# Altium schematic sheet MC21R01_BoardtoBoard_connectors.SchDoc: MC21R01 Top Level
size A3; Author: AMP; DrawnBy: AMP; Organization: Altium Limited; Address1: 3 Minna Close; Address2: Belrose; Address3: NSW 2085; Address4: Australia; DocumentNumber: 0; Revision: 1.0; SheetNumber: 0; SheetTotal: 0
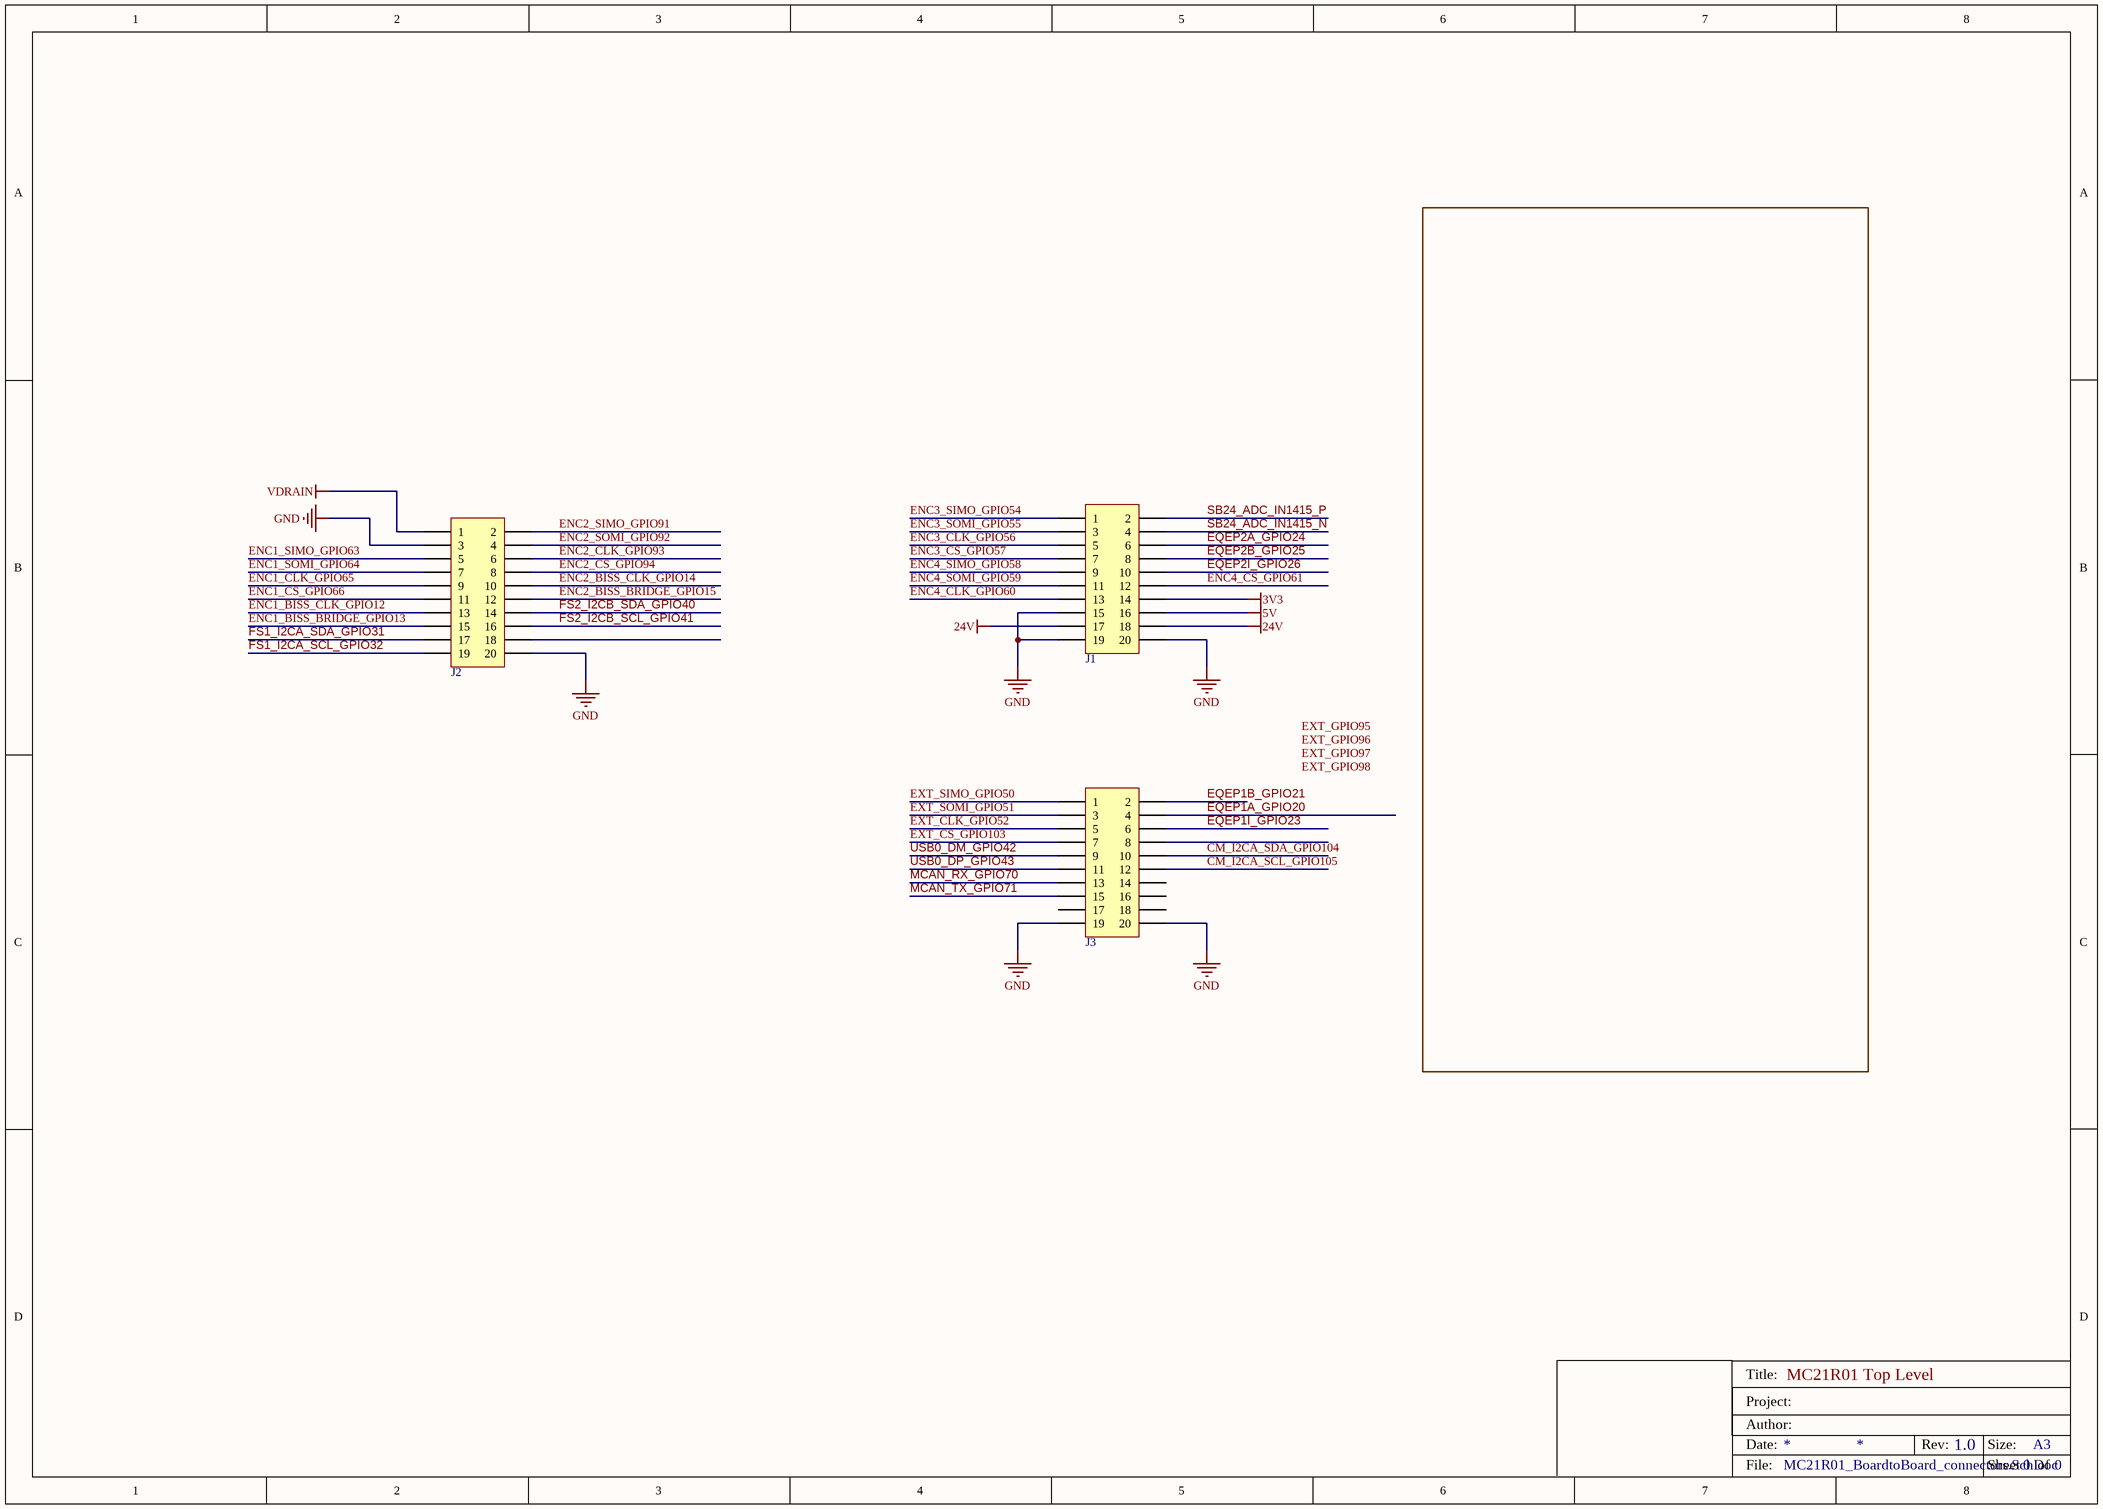
[diagram p0: MC21R01_BoardtoBoard_connectors.SchDoc]

## Parts
J1  Amphenol 20021321-00020C4LF  [Amphenol 20021321-10020C4LF]  (value not drawn)
J2  Amphenol 20021321-00020C4LF  [Amphenol 20021321-10020C4LF]  (value not drawn)
J3  Amphenol 20021321-00020C4LF  [Amphenol 20021321-10020C4LF]  (value not drawn)

## Nets
3V3: J1.14
5V: J1.16
24V: J1.17 J1.18
GND: J1.15 J1.19 J1.20 J2.3 J2.20 J3.19 J3.20
VDRAIN: J2.1
CM_I2CA_SCL_GPIO105: J3.12
CM_I2CA_SDA_GPIO104: J3.10
ENC1_BISS_BRIDGE_GPIO13: J2.15
ENC1_BISS_CLK_GPIO12: J2.13
ENC1_CLK_GPIO65: J2.9
ENC1_CS_GPIO66: J2.11
ENC1_SIMO_GPIO63: J2.5
ENC1_SOMI_GPIO64: J2.7
ENC2_BISS_BRIDGE_GPIO15: J2.12
ENC2_BISS_CLK_GPIO14: J2.10
ENC2_CLK_GPIO93: J2.6
ENC2_CS_GPIO94: J2.8
ENC2_SIMO_GPIO91: J2.2
ENC2_SOMI_GPIO92: J2.4
ENC3_CLK_GPIO56: J1.5
ENC3_CS_GPIO57: J1.7
ENC3_SIMO_GPIO54: J1.1
ENC3_SOMI_GPIO55: J1.3
ENC4_CLK_GPIO60: J1.13
ENC4_CS_GPIO61: J1.12
ENC4_SIMO_GPIO58: J1.9
ENC4_SOMI_GPIO59: J1.11
EQEP1A_GPIO20: J3.4
EQEP1B_GPIO21: J3.2
EQEP1I_GPIO23: J3.6
EQEP2A_GPIO24: J1.6
EQEP2B_GPIO25: J1.8
EQEP2I_GPIO26: J1.10
EXT_CLK_GPIO52: J3.5
EXT_CS_GPIO103: J3.7
EXT_SIMO_GPIO50: J3.1
EXT_SOMI_GPIO51: J3.3
FS1_I2CA_SCL_GPIO32: J2.19
FS1_I2CA_SDA_GPIO31: J2.17
FS2_I2CB_SCL_GPIO41: J2.16
FS2_I2CB_SDA_GPIO40: J2.14
MCAN_RX_GPIO70: J3.13
MCAN_TX_GPIO71: J3.15
SB24_ADC_IN1415_N: J1.4
SB24_ADC_IN1415_P: J1.2
USB0_DM_GPIO42: J3.9
USB0_DP_GPIO43: J3.11

Not connected (* = marked no-connect by the designer): J2 18; J3 8 14 16 17 18

## Notes on the sheet
- Title:
- Date:
- Project:
- Author:
- Rev:
- Size:
- A3
- File:
- Sheet
- of
- Labels drawn without touching a wire or pin: EXT_GPIO95, EXT_GPIO96, EXT_GPIO97, EXT_GPIO98

## Library data of the parts
J1-J3 = Amphenol 20021321-00020C4LF: Receptacle, Minitek127®, Board to Board connectors, PCB mounted Receptacle, Vertical, Surface Mount, Double Row, 20 Positions, 1.27mm (0.05inch) pitch; Manufacturer: Amphenol; Manufacturer Part Number: 20021321-00020C4LF; Supplier 1: Farnell; Supplier Part Number 1: 1865312